# EAGLE design Teensylu-1.1 (EAGLE 7.1.0)
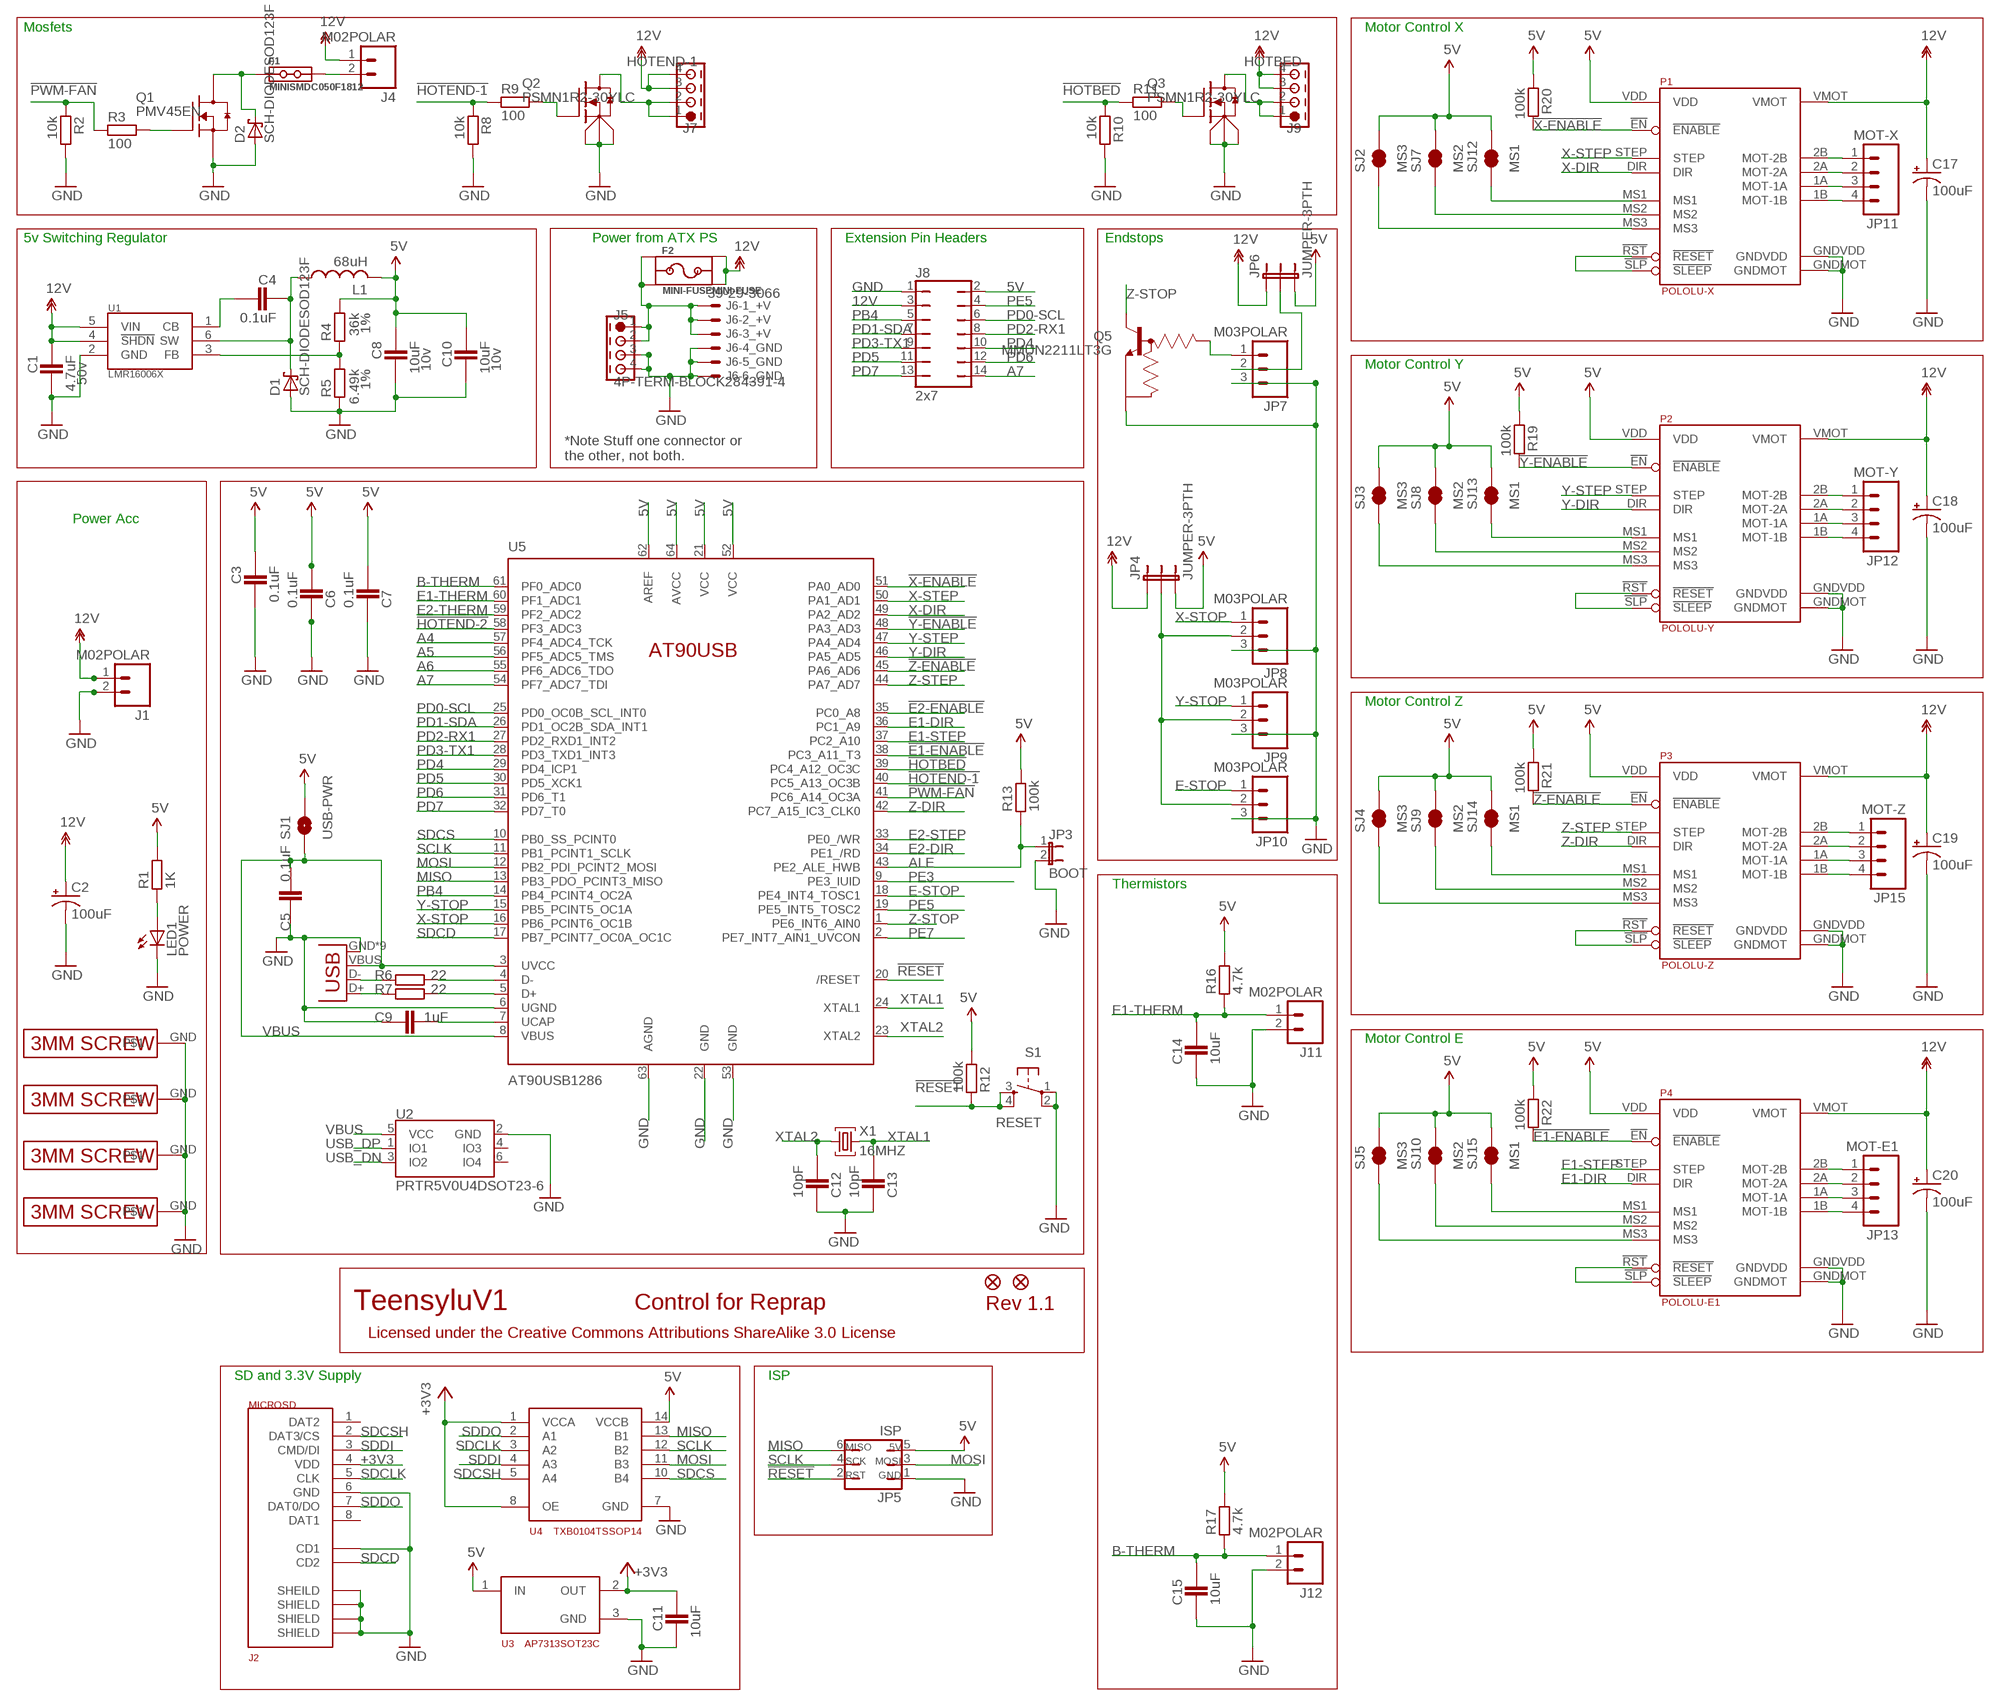
[diagram p0: schematic, sheet 1]

## Parts
C1  4.7uF  CAPACITOR_1206  [CAPC3215X168N]
C2  100uF  CPOL-USD  [PANASONIC_D]
C3  0.1uF  CAPACITOR_0603  [CAPC1608X92N]
C4  0.1uF  CAPACITOR_0603  [CAPC1608X92N]
C5  0.1uF  CAPACITOR_0603  [CAPC1608X92N]
C6  0.1uF  CAPACITOR_0603  [CAPC1608X92N]
C7  0.1uF  CAPACITOR_0603  [CAPC1608X92N]
C8  10uF  CAPACITOR_0805  [CAPC2012X145AN]
C9  1uF  CAPACITOR_0603  [CAPC1608X92N]
C10  10uF  CAPACITOR_0805  [CAPC2012X145AN]
C11  10uF  CAPACITOR_0603  [CAPC1608X92N]
C12  10pF  CAPACITOR_0603  [CAPC1608X92N]
C13  10pF  CAPACITOR_0603  [CAPC1608X92N]
C14  10uF  CAPACITOR_0603  [CAPC1608X92N]
C15  10uF  CAPACITOR_0603  [CAPC1608X92N]
C17  100uF  CPOL-USD  [PANASONIC_D]
C18  100uF  CPOL-USD  [PANASONIC_D]
C19  100uF  CPOL-USD  [PANASONIC_D]
C20  100uF  CPOL-USD  [PANASONIC_D]
D1  SCH-DIODESOD123F  [SOD123F]
D2  SCH-DIODESOD123F  [SOD123F]
F1  MINISMDC050F1812  [MINISMDC]
F2  MINI-FUSEMINI-FUSE  [MINI_FUSE]
J1  M02POLAR  [MOLEX-1X2]
J2  MICROSD  [AMPHENOL-MICROSD]
J3  USB-MICRO-PTH  [USB-MICROB-PTH]
J4  M02POLAR  [MOLEX-1X2]
J5  4P-TERM-BLOCK284391-4  [284391-4]
J6  39-29-3066  [39-29-3066]
J7  HOTEND-1  4P-TERM-BLOCK284391-4  [284391-4]
J8  2x7  JP7Q  [JP7Q]
J9  HOTBED  4P-TERM-BLOCK284391-4  [284391-4]
J11  M02POLAR  [MOLEX-1X2]
J12  M02POLAR  [MOLEX-1X2]
JP1  FIDUCIAL1X2.5  [FIDUCIAL-1X2.5]
JP2  FIDUCIAL1X2.5  [FIDUCIAL-1X2.5]
JP3  BOOT  JUMPER-2PTH  [1X02]
JP4  JUMPER-3PTH  [1X03]
JP5  ISP  PROGHEADER  [ISP]
JP6  JUMPER-3PTH  [1X03]
JP7  M03POLAR  [MOLEX-1X3]
JP8  M03POLAR  [MOLEX-1X3]
JP9  M03POLAR  [MOLEX-1X3]
JP10  M03POLAR  [MOLEX-1X3]
JP11  MOT-X  M04POLAR  [MOLEX-1X4]
JP12  MOT-Y  M04POLAR  [MOLEX-1X4]
JP13  MOT-E1  M04POLAR  [MOLEX-1X4]
JP15  MOT-Z  M04POLAR  [MOLEX-1X4]
L1  68uH  INDUCTORSRN6045  [SRN6045]
LED1  POWER  LEDCHIPLED_0805  [CHIPLED_0805]
P1  POLOLU-X  POLOLU-ALLEGRO  [POLOLU-STEPPER-PTH]
P2  POLOLU-Y  POLOLU-ALLEGRO  [POLOLU-STEPPER-PTH]
P3  POLOLU-Z  POLOLU-ALLEGRO  [POLOLU-STEPPER-PTH]
P4  POLOLU-E1  POLOLU-ALLEGRO  [POLOLU-STEPPER-PTH]
Q1  PMV45EN  MOSFET-NCH_SOT-23  [SOT23C]
Q2  PSMN1R2-30YLC  PSMN1R2-30YLCPOWERPACK-S08  [LFPACK-POWERPAK-SO8]
Q3  PSMN1R2-30YLC  PSMN1R2-30YLCPOWERPACK-S08  [LFPACK-POWERPAK-SO8]
Q5  MMUN2211LT3G  TRANSISTOR_NPN_BIASSOT23C  [SOT23C]
R1  1K  RESISTOR_0603  [RESC1608X55N]
R2  10k  RESISTOR_0603  [RESC1608X55N]
R3  100  RESISTOR_0603  [RESC1608X55N]
R4  36k  RESISTOR_0603  [RESC1608X55N]
R5  6.49k  RESISTOR_0603  [RESC1608X55N]
R6  22  RESISTOR_0603  [RESC1608X55N]
R7  22  RESISTOR_0603  [RESC1608X55N]
R8  10k  RESISTOR_0603  [RESC1608X55N]
R9  100  RESISTOR_0603  [RESC1608X55N]
R10  10k  RESISTOR_0603  [RESC1608X55N]
R11  100  RESISTOR_0603  [RESC1608X55N]
R12  100k  RESISTOR_0603  [RESC1608X55N]
R13  100k  RESISTOR_0603  [RESC1608X55N]
R16  4.7k  RESISTOR_0603  [RESC1608X55N]
R17  4.7k  RESISTOR_0603  [RESC1608X55N]
R19  100k  RESISTOR_0603  [RESC1608X55N]
R20  100k  RESISTOR_0603  [RESC1608X55N]
R21  100k  RESISTOR_0603  [RESC1608X55N]
R22  100k  RESISTOR_0603  [RESC1608X55N]
S1  RESET  TAC_SWITCHSMD  [TACTILE_SWITCH_SMD]
SCREW1  3MM-SCREW  [PLATEDSCREW]
SCREW2  3MM-SCREW  [PLATEDSCREW]
SCREW3  3MM-SCREW  [PLATEDSCREW]
SCREW4  3MM-SCREW  [PLATEDSCREW]
SJ1  USB-PWR  SOLDERJUMPERNO  [SJ_2S-NO]
SJ2  MS3  SOLDERJUMPER-NCSJ-TRACE  [SJ_2S-TRACE]
SJ3  MS3  SOLDERJUMPER-NCSJ-TRACE  [SJ_2S-TRACE]
SJ4  MS3  SOLDERJUMPER-NCSJ-TRACE  [SJ_2S-TRACE]
SJ5  MS3  SOLDERJUMPER-NCSJ-TRACE  [SJ_2S-TRACE]
SJ7  MS2  SOLDERJUMPER-NCSJ-TRACE  [SJ_2S-TRACE]
SJ8  MS2  SOLDERJUMPER-NCSJ-TRACE  [SJ_2S-TRACE]
SJ9  MS2  SOLDERJUMPER-NCSJ-TRACE  [SJ_2S-TRACE]
SJ10  MS2  SOLDERJUMPER-NCSJ-TRACE  [SJ_2S-TRACE]
SJ12  MS1  SOLDERJUMPER-NCSJ-TRACE  [SJ_2S-TRACE]
SJ13  MS1  SOLDERJUMPER-NCSJ-TRACE  [SJ_2S-TRACE]
SJ14  MS1  SOLDERJUMPER-NCSJ-TRACE  [SJ_2S-TRACE]
SJ15  MS1  SOLDERJUMPER-NCSJ-TRACE  [SJ_2S-TRACE]
U1  LMR16006X  [TSOT6]
U2  PRTR5V0U4DSOT23-6  [SOT23-6]
U3  AP7313SOT23C  [SOT23C]
U4  TXB0104TSSOP14  [TSSOP14]
U5  AT90USB1286  AT90USB  [TQFP64-2]
X1  16MHZ  XTAL  [NDK-XTAL]

## Nets
5V [power]: C3.1 C6.2 C7.2 C8.1 C10.1 J8.2 JP4.3 JP5.5 JP6.3 L1.2 P1.VDD P2.VDD P3.VDD P4.VDD R1.2 R4.1 R12.2 R13.2 R16.2 R17.2 R19.1 R20.1 R21.1 R22.1 SJ1.2 SJ2.2 SJ3.2 SJ4.2 SJ5.2 SJ7.2 SJ8.2 SJ9.2 SJ10.2 SJ12.2 SJ13.2 SJ14.2 SJ15.2 U3.1(IN) U4.14(VCCB) U5.21(VCC) U5.52(VCC) U5.62(AREF) U5.64(AVCC)
5VREG_CB: C4.2 U1.1(CB)
5VREG_FB: R4.2 R5.1 U1.3(FB)
5VREG_SW: C4.1 D1.C L1.1 U1.6(SW)
12V: C1.1 C2.+ C17.+ C18.+ C19.+ C20.+ F2.P$3 F2.P$4 J1.1 J4.1 J7.3 J7.4 J8.3 J9.3 J9.4 JP4.1 JP6.1 P1.VMOT P2.VMOT P3.VMOT P4.VMOT U1.4(!SHDN) U1.5(VIN)
12V_FUSE: F2.P$1 F2.P$2 J5.1 J5.2 J6.1 J6.2 J6.3
!E1-ENABLE: P4.!EN(!ENABLE) R22.2 U5.38(PC3_A11_T3)
!E2-ENABLE: U5.35(PC0_A8)
!HOTBED: R10.1 R11.1 U5.39(PC4_A12_OC3C)
!HOTEND-1: R8.1 R9.1 U5.40(PC5_A13_OC3B)
!HOTEND-2: U5.58(PF3_ADC3)
!PWM-FAN: R2.1 R3.1 U5.41(PC6_A14_OC3A)
!RESET: JP5.2 R12.1 S1.3 S1.4 U5.20(/RESET)
!X-ENABLE: P1.!EN(!ENABLE) R20.2 U5.51(PA0_AD0)
!Y-ENABLE: P2.!EN(!ENABLE) R19.2 U5.48(PA3_AD3)
!Z-ENABLE: P3.!EN(!ENABLE) R21.2 U5.45(PA6_AD6)
+3V3 [power]: C11.1 J2.4(VDD) U3.2(OUT) U4.1(VCCA) U4.8(OE)
A4: U5.57(PF4_ADC4_TCK)
A5: U5.56(PF5_ADC5_TMS)
A6: U5.55(PF6_ADC6_TDO)
A7: J8.14 U5.54(PF7_ADC7_TDI)
ALE: JP3.1 R13.1 U5.43(PE2_ALE_HWB)
B-THERM: C15.2 J12.1 R17.1 U5.61(PF0_ADC0)
E1-DIR: P4.DIR U5.36(PC1_A9)
E1-STEP: P4.STEP U5.37(PC2_A10)
E1-THERM: C14.2 J11.1 R16.1 U5.60(PF1_ADC1)
E2-DIR: U5.34(PE1_/RD)
E2-STEP: U5.33(PE0_/WR)
E2-THERM: U5.59(PF2_ADC2)
E-MOT-1A [power]: JP13.3 P4.1A(MOT-1A)
E-MOT-1B [power]: JP13.4 P4.1B(MOT-1B)
E-MOT-2A [power]: JP13.2 P4.2A(MOT-2A)
E-MOT-2B [power]: JP13.1 P4.2B(MOT-2B)
E-MS1: P4.MS1 SJ15.1
E-MS2: P4.MS2 SJ10.1
E-MS3: P4.MS3 SJ5.1
E-RESETSLEEP: P4.!RST(!RESET) P4.!SLP(!SLEEP)
E-STOP: JP10.1 U5.18(PE4_INT4_TOSC1)
ENDSTOP+V: JP4.2 JP8.2 JP9.2 JP10.2
GND [power]: C1.2 C2.- C3.2 C5.1 C6.1 C7.1 C8.2 C9.1 C10.2 C11.2 C12.1 C13.1 C14.1 C15.1 C17.- C18.- C19.- C20.- D1.A D2.A J1.2 J2.6(GND) J2.C1(SHEILD) J2.C2(SHIELD) J2.C3(SHIELD) J2.C4(SHIELD) J2.CD1 J3.GND J3.GND1(GND) J3.GND2(GND) J3.GND3(GND) J3.GND4(GND) J3.GND5(GND) J3.GND6(GND) J3.GND7(GND) J3.GND8(GND) J5.3 J5.4 J6.4 J6.5 J6.6 J8.1 J11.2 J12.2 JP3.2 JP5.1 JP7.3 JP8.3 JP9.3 JP10.3 LED1.C P1.GNDMOT P1.GNDVDD P2.GNDMOT P2.GNDVDD P3.GNDMOT P3.GNDVDD P4.GNDMOT P4.GNDVDD Q1.2(S) Q2.1(S1) Q2.2(S2) Q2.3(S3) Q3.1(S1) Q3.2(S2) Q3.3(S3) Q5.2(E) R2.2 R5.2 R8.2 R10.2 S1.1 S1.2 SCREW1.GND SCREW2.GND SCREW3.GND SCREW4.GND U1.2(GND) U2.2(GND) U3.3(GND) U4.7(GND) U5.6(UGND) U5.22(GND) U5.53(GND) U5.63(AGND)
HOTBED-GND [power]: J9.1 J9.2 Q3.5-8(D)
HOTEND-GND [power]: J7.1 J7.2 Q2.5-8(D)
MISO: JP5.6 U4.13(B1) U5.13(PB3_PDO_PCINT3_MISO)
MOSI: JP5.3 U4.11(B3) U5.12(PB2_PDI_PCINT2_MOSI)
N$1: LED1.A R1.1
N$2: Q3.4(G) R11.2
N$3: R6.2 U5.4(D-)
N$4: R7.2 U5.5(D+)
N$5: F1.P$2 J4.2
N$6: D2.C F1.P$1 Q1.3(D)
N$10: Q1.1(G) R3.2
N$11: Q2.4(G) R9.2
PB4: J8.5 U5.14(PB4_PCINT4_OC2A)
PD0-SCL: J8.6 U5.25(PD0_OC0B_SCL_INT0)
PD1-SDA: J8.7 U5.26(PD1_OC2B_SDA_INT1)
PD2-RX1: J8.8 U5.27(PD2_RXD1_INT2)
PD3-TX1: J8.9 U5.28(PD3_TXD1_INT3)
PD4: J8.10 U5.29(PD4_ICP1)
PD5: J8.11 U5.30(PD5_XCK1)
PD6: J8.12 U5.31(PD6_T1)
PD7: J8.13 U5.32(PD7_T0)
PE3: U5.9(PE3_IUID)
PE5: J8.4 U5.19(PE5_INT5_TOSC2)
PE7: U5.2(PE7_INT7_AIN1_UVCON)
SCLK: JP5.4 U4.12(B2) U5.11(PB1_PCINT1_SCLK)
SDCD: J2.CD2 U5.17(PB7_PCINT7_OC0A_OC1C)
SDCLK: J2.5(CLK) U4.3(A2)
SDCS: U4.10(B4) U5.10(PB0_SS_PCINT0)
SDCSH: J2.2(DAT3/CS) U4.5(A4)
SDDI: J2.3(CMD/DI) U4.4(A3)
SDDO: J2.7(DAT0/DO) U4.2(A1)
UCAP: C9.2 U5.7(UCAP)
USB_DN: J3.D- R6.1 U2.3(IO2)
USB_DP: J3.D+ R7.1 U2.1(IO1)
VBUS: C5.2 J3.VBUS SJ1.1 U2.5(VCC) U5.3(UVCC) U5.8(VBUS)
X-DIR: P1.DIR U5.49(PA2_AD2)
X-MOT-1A [power]: JP11.3 P1.1A(MOT-1A)
X-MOT-1B [power]: JP11.4 P1.1B(MOT-1B)
X-MOT-2A [power]: JP11.2 P1.2A(MOT-2A)
X-MOT-2B [power]: JP11.1 P1.2B(MOT-2B)
X-MS1: P1.MS1 SJ12.1
X-MS2: P1.MS2 SJ7.1
X-MS3: P1.MS3 SJ2.1
X-RESETSLEEP: P1.!RST(!RESET) P1.!SLP(!SLEEP)
X-STEP: P1.STEP U5.50(PA1_AD1)
X-STOP: JP8.1 U5.16(PB6_PCINT6_OC1B)
XTAL1: C13.2 U5.24(XTAL1) X1.P$2
XTAL2: C12.2 U5.23(XTAL2) X1.P$1
Y-DIR: P2.DIR U5.46(PA5_AD5)
Y-MOT-1A [power]: JP12.3 P2.1A(MOT-1A)
Y-MOT-1B [power]: JP12.4 P2.1B(MOT-1B)
Y-MOT-2A [power]: JP12.2 P2.2A(MOT-2A)
Y-MOT-2B [power]: JP12.1 P2.2B(MOT-2B)
Y-MS1: P2.MS1 SJ13.1
Y-MS2: P2.MS2 SJ8.1
Y-MS3: P2.MS3 SJ3.1
Y-RESETSLEEP: P2.!RST(!RESET) P2.!SLP(!SLEEP)
Y-STEP: P2.STEP U5.47(PA4_AD4)
Y-STOP: JP9.1 U5.15(PB5_PCINT5_OC1A)
Z-DIR: P3.DIR U5.42(PC7_A15_IC3_CLK0)
Z-MOT-1A [power]: JP15.3 P3.1A(MOT-1A)
Z-MOT-1B [power]: JP15.4 P3.1B(MOT-1B)
Z-MOT-2A [power]: JP15.2 P3.2A(MOT-2A)
Z-MOT-2B [power]: JP15.1 P3.2B(MOT-2B)
Z-MS1: P3.MS1 SJ14.1
Z-MS2: P3.MS2 SJ9.1
Z-MS3: P3.MS3 SJ4.1
Z-RESETSLEEP: P3.!RST(!RESET) P3.!SLP(!SLEEP)
Z-STEP: P3.STEP U5.44(PA7_AD7)
Z-STOP: Q5.3(C) U5.1(PE6_INT6_AIN0)
Z-STOP-BIAS: JP7.1 Q5.1(B)
Z-STOP-SUPPLY: JP6.2 JP7.2
Unconnected: J2.1(DAT2) J2.8(DAT1) U2.4(IO3) U2.6(IO4)

## Notes on the sheet
- Mosfets | Motor Control X
- 5v Switching Regulator | Power from ATX PS | Extension Pin Headers | Endstops
- Motor Control Y
- *Note Stuff one connector or
  the other, not both.
- Power Acc
- Motor Control Z
- Thermistors
- Motor Control E
- TeensyluV1 | Control for Reprap | Rev 1.1
- Licensed under the Creative Commons Attributions ShareAlike 3.0 License
- SD and 3.3V Supply | ISP

## Library data of the parts
C1 = teensylu:CAPACITOR_; MANUFACTURER: Yaiyo Yuden; MANUFACTURER_PART_NUMBER: UMK316AB7475KL-T; TOLERANCE: 10%; VDC: 50v
C2 C17-C20 = teensylu:CPOL-US: POLARIZED CAPACITOR, American symbol; MANUFACTURER: Panasonic; MANUFACTURER_PART_NUMBER: EEE-FTH101XAP; TOLERANCE: 20%; VDC: 50v
C3 C5-C7 = teensylu:CAPACITOR_; MANUFACTURER: Murata; MANUFACTURER_PART_NUMBER: GRM188R71C104KA01D; TOLERANCE: 10%; VDC: 16V
C4 = teensylu:CAPACITOR_; MANUFACTURER: Samsung; MANUFACTURER_PART_NUMBER: CL10B104KB8NNNC; TOLERANCE: 10%; VDC: 50V
C8 C10 = teensylu:CAPACITOR_; ESR: 0.0030; MANUFACTURER: Murata; MANUFACTURER_PART_NUMBER: GRM21BR71A106KE51L; TOLERANCE: 10%; VDC: 10v
C9 = teensylu:CAPACITOR_; MANUFACTURER: Samsung; MANUFACTURER_PART_NUMBER: CL10A105MO8NNNC; TOLERANCE: 20%; VDC: 16V
C11 C14 C15 = teensylu:CAPACITOR_; MANUFACTURER: Murata; MANUFACTURER_PART_NUMBER: GRM188R61C106MA73D; TOLERANCE: 20%; VDC: 16V
C12 C13 = teensylu:CAPACITOR_; MANUFACTURER: Samsung; MANUFACTURER_PART_NUMBER: CL10C100JB8NCNC; TOLERANCE: 5%; VDC: 50V
D1 D2 = teensylu:SCH-DIODE: Schottky Diodes Source: Fairchild .. BAT54.pdf; CURRENT: 1A; MANUFACTURER: NXP Semiconductors; MANUFACTURER_PART_NUMBER: PMEG4010CEH,115; REVERSE_VOLTAGE: 40V
F1 = teensylu:MINISMDC050F; CURRENT: 0.5A; MANUFACTURER: TE Connectivity; MANUFACTURER_PART_NUMBER: MINISMDC050F-2
F2 = teensylu:MINI-FUSE; CURRENT: 15A; MANUFACTURER: Keystone; MANUFACTURER_PART_NUMBER: 3568
J1 J4 J11 J12 = teensylu:M02: Header 2 Standard 2-pin 0.1" header. Use with straight break away headers (SKU : PRT-00116), right angle break away headers (PRT-00553), swiss pins (PRT-00743), machine pins (PRT-00117), and female headers (PRT-00115). Molex polarized connector foot print use with SKU : PRT-08233 with associated crimp pins and housings.; DESCRIPTION: CONN HEADER 2POS .100 VERT TIN; MANUFACTURER: Molex; MANUFACTURER_PART_NUMBER: 0022272021; NOTES: Can use alternative part for Right Angle. MFG: TE Connectivity PN: 640455-2
J2 = teensylu:MICROSD; DESCRIPTION: CONN MICRO SD CARD PUSH-PULL R/A; MANUFACTURER: Amphenol; MANUFACTURER_PART_NUMBER: 114-00841-68
J3 = teensylu:USB: USB Connectors USB-B-PTH is fully proven SKU : PRT-00139 USB-miniB is fully proven SKU : PRT-00587 USB-A-PCB is untested. USB-A-H is throughly reviewed, but untested. Spark Fun Electronics SKU : PRT-00437 USB-B-SMT is throughly reviewed, but untested. Needs silkscreen touching up. USB-A-S has not been used/tested USB-MB-H has not been used/tested; MANUFACTURER: FCI; MANUFACTURER_PART_NUMBER: 10118194-0001LF
J5 J7 J9 = teensylu:4P-TERM-BLOCK; CURRENT: 12A; MANUFACTURER: TE Connectivity; MANUFACTURER_PART_NUMBER: 284391-4
J6 = teensylu:39-29-3066: Mini FIT connector 6 pol Without Snap-in peg Source: http://www.molex.com; MANUFACTURER: Molex; MANUFACTURER_PART_NUMBER: 0039293066
J8 = teensylu:JP7Q: JUMPER; DESCRIPTION: DIL VERTICAL PC TAIL PIN HEADER; MANUFACTURER: Harwin; MANUFACTURER_PART_NUMBER: M20-9980746
JP1 JP2 = SparkFun:FIDUCIAL: Fiducial Alignment Points Various fiducial points for machine vision alignment.
JP3 = teensylu:JUMPER-2: Jumper Basic 0.1" spaced jumper. Use with breakaway headers.; DESCRIPTION: SIL VERTICAL PC TAIL PIN HEADER; MANUFACTURER: Harwin; MANUFACTURER_PART_NUMBER: M20-9990246
JP4 JP6 = teensylu:JUMPER-3
JP5 = teensylu:PROGHEADER: JUMPER
JP7-JP10 = teensylu:M03: Header 3 Standard 3-pin 0.1" header. Use with straight break away headers (SKU : PRT-00116), right angle break away headers (PRT-00553), swiss pins (PRT-00743), machine pins (PRT-00117), and female headers (PRT-00115). Molex polarized connector foot print use with SKU : PRT-08232 with associated crimp pins and housings.; DESCRIPTION: CONN HEADER 3POS .100 VERT TIN; MANUFACTURER: Molex; MANUFACTURER_PART_NUMBER: 0022272031; NOTES: Can use alternative part for Right Angle. MFG: TE Connectivity PN: 640455-3
JP11-JP13 JP15 = teensylu:M04: Header 4 Standard 4-pin 0.1" header. Use with straight break away headers (SKU : PRT-00116), right angle break away headers (PRT-00553), swiss pins (PRT-00743), machine pins (PRT-00117), and female headers (PRT-00115). Molex polarized connector foot print use with SKU : PRT-08231 with associated crimp pins and housings. 1MM SMD Version SKU: PRT-10208; DESCRIPTION: CONN HEADER 4POS .100 VERT TIN; MANUFACTURER: Molex; MANUFACTURER_PART_NUMBER: 0022272041; NOTES: Can use alternative part for Right Angle. MFG: TE Connectivity PN: 640455-4
L1 = teensylu:INDUCTOR; CURRENT: 900mA; DCR: 0.351; INDUCTANCE: 68uH; IRMS: 0.9A; MANUFACTURER: Bourns; MANUFACTURER_PART_NUMBER: SRN6045-680M
LED1 = teensylu:LED: LED OSRAM: - CHIPLED LG R971, LG N971, LY N971, LG Q971, LY Q971, LO R971, LY R971 LH N974, LH R974 LS Q976, LO Q976, LY Q976 LO Q996 - Hyper CHIPLED LW Q18S LB Q993, LB Q99A, LB R99A - SideLED LS A670, LO A670, LY A670, LG A670, LP A670 LB A673, LV A673, LT A673, LW A673 LH A674 LY A675 LS A676, LA A676, LO A676, LY A676, LW A676 LS A679, LY A679, LG A679 - Hyper Micro SIDELED® LS Y876, LA Y876, LO Y876, LY Y876 LT Y87S - SmartLED LW L88C, LW L88S LB L89C, LB L89S, LG L890 LS L89K, LO L89K, LY L89K LS L896, LA L896, LO L896, LY L896 - TOPLED LS T670, LO T670, LY T670, LG T670, LP T670 LSG T670, LSP T670, LSY T670, LOP T670, LYG T670 LG T671, LOG T671, LSG T671 LB T673, LV T673, LT T673, LW T673 LH T674 LS T676, LA T676, LO T676, LY T676, LB T676, LH T676, LSB T676, LW T676 LB T67C, LV T67C, LT T67C, LS T67K, LO T67K, LY T67K, LW E67C LS E67B, LA E67B, LO E67B, LY E67B, LB E67C, LV E67C, LT E67C LW T67C LS T679, LY T679, LG T679 LS T770, LO T770, LY T770, LG T770, LP T770 LB T773, LV T773, LT T773, LW T773 LH T774 LS E675, LA E675, LY E675, LS T675 LS T776, LA T776, LO T776, LY T776, LB T776 LHGB T686 LT T68C, LB T68C - Hyper Mini TOPLED® LB M676 - Mini TOPLED Santana® LG M470 LS M47K, LO M47K, LY M47K Source: http://www.osram.convergy.de LUXEON: - LUMILED® LXK2-PW12-R00, LXK2-PW12-S00, LXK2-PW14-U00, LXK2-PW14-V00 LXK2-PM12-R00, LXK2-PM12-S00, LXK2-PM14-U00 LXK2-PE12-Q00, LXK2-PE12-R00, LXK2-PE12-S00, LXK2-PE14-T00, LXK2-PE14-U00 LXK2-PB12-K00, LXK2-PB12-L00, LXK2-PB12-M00, LXK2-PB14-N00, LXK2-PB14-P00, LXK2-PB14-Q00 LXK2-PR12-L00, LXK2-PR12-M00, LXK2-PR14-Q00, LXK2-PR14-R00 LXK2-PD12-Q00, LXK2-PD12-R00, LXK2-PD12-S00 LXK2-PH12-R00, LXK2-PH12-S00 LXK2-PL12-P00, LXK2-PL12-Q00, LXK2-PL12-R00 Source: www.luxeon.com KINGBRIGHT: KA-3528ASYC Source: www.kingbright.com; MANUFACTURER: Kingbright; MANUFACTURER_PART_NUMBER: APT2012SGC
P1-P4 = teensylu:POLOLU-ALLEGRO
Q1 = teensylu:MOSFET-NCH_; CURRENT: 1.2A; MANUFACTURER: International Rectifier; MANUFACTURER_PART_NUMBER: IRLML2060TRPBF; VOLTAGE: 60V
Q2 Q3 = teensylu:PSMN1R2-30YLC: N-Channel MOSFET - 30V 100A LFPAK; CURRENT: 100A; MANUFACTURER: NXP Semiconductors; MANUFACTURER_PART_NUMBER: PSMN1R2-30YLC,115; RDS_ON: 1.25mOhm; VGS: 1.95V; VOLTAGE: 30V
Q5 = teensylu:TRANSISTOR_NPN_BIAS: Transistor NPN BJT configuration in SOT23 package. MMBT2222 is the common NPN we use. Double check BCE configuration again layout.; DESCRIPTION: TRANS PREBIAS NPN 246MW SOT23-3; MANUFACTURER: ON Semiconductor; MANUFACTURER_PART_NUMBER: MMUN2211LT3G
R1-R3 R6-R13 R16 R17 R19-R22 = teensylu:RESISTOR_
R4 R5 = teensylu:RESISTOR_; TOLERANCE: 1%
S1 = teensylu:TAC_SWITCH: Momentary Switch Button commonly used for reset or general input. Spark Fun Electronics SKU : COM-00097; MANUFACTURER: Bourns; MANUFACTURER_PART_NUMBER: 7914J-1-000E
SCREW1-SCREW4 = teensylu:3MM-SCREW: 3mm Plated Through Hole Screw
SJ1 = teensylu:SOLDERJUMPER: Solder Jumper Standard SMD solder jumper. Used to automate production. Two varients : Normally Open and Normally Closed are the same, but have different paste layers. NC will have a large amount of paste and should jumper during reflow.
SJ2-SJ5 SJ7-SJ10 SJ12-SJ15 = teensylu:SOLDERJUMPER-NC
U1 = teensylu:LMR16006X: Texas Instruments LMR16006XDDCT; CURRENT: 600mA; MANUFACTURER: Texas Instruments; MANUFACTURER_PART_NUMBER: LMR16006XDDCT
U2 = teensylu:PRTR5V0U4D: NXP Semiconductors PRTR5V0U4D,125; MANUFACTURER: NXP Semiconductors; MANUFACTURER_PART_NUMBER: PRTR5V0U4D,125
U3 = teensylu:AP7313; CURRENT: 150mA; DESCRIPTION: IC REG LDO 3.3V 0.15A SOT23-3; MANUFACTURER: Diodes Incorporated; MANUFACTURER_PART_NUMBER: AP7313-33SAG-7; VOLTAGE_OUTPUT: 3.3V
U4 = teensylu:TXB0104; DESCRIPTION: IC VOLT-LEVEL TRANSLATOR 14TSSOP; MANUFACTURER: Texas Instruments; MANUFACTURER_PART_NUMBER: TXB0104PWR
U5 = teensylu:AT90USB; MANUFACTURER: Atmel; MANUFACTURER_PART_NUMBER: AT90USB1286
X1 = teensylu:XTAL; MANUFACTURER: NDK; MANUFACTURER_PART_NUMBER: NX5032GA-16.000000MHZ-LN-CD-1

## Board
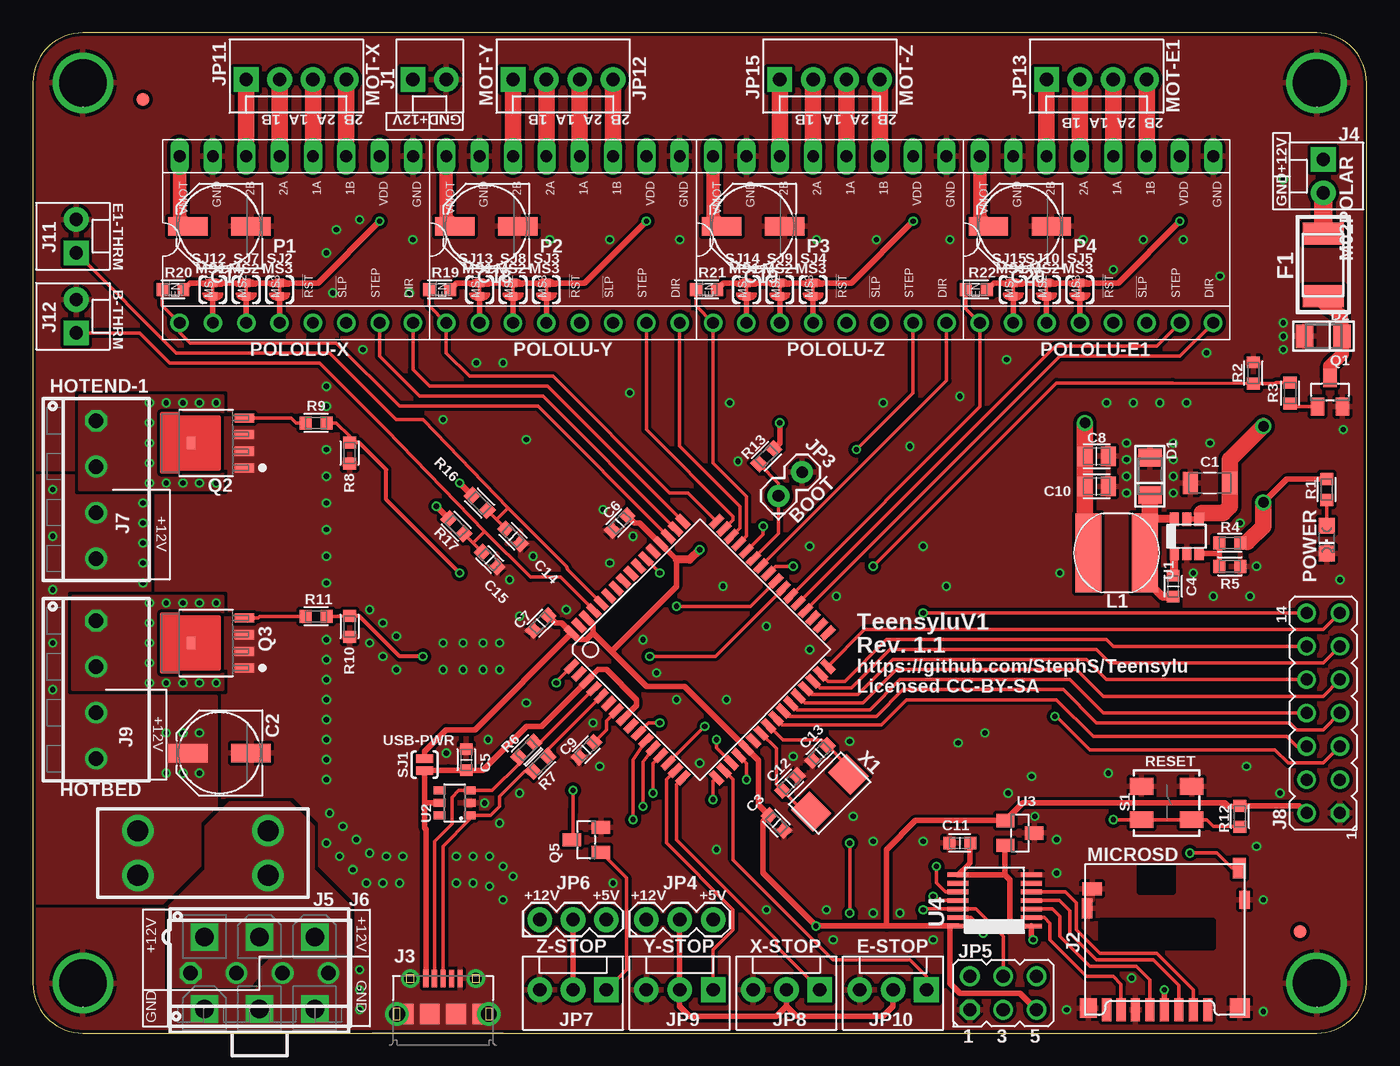
[diagram p1: board, top side]
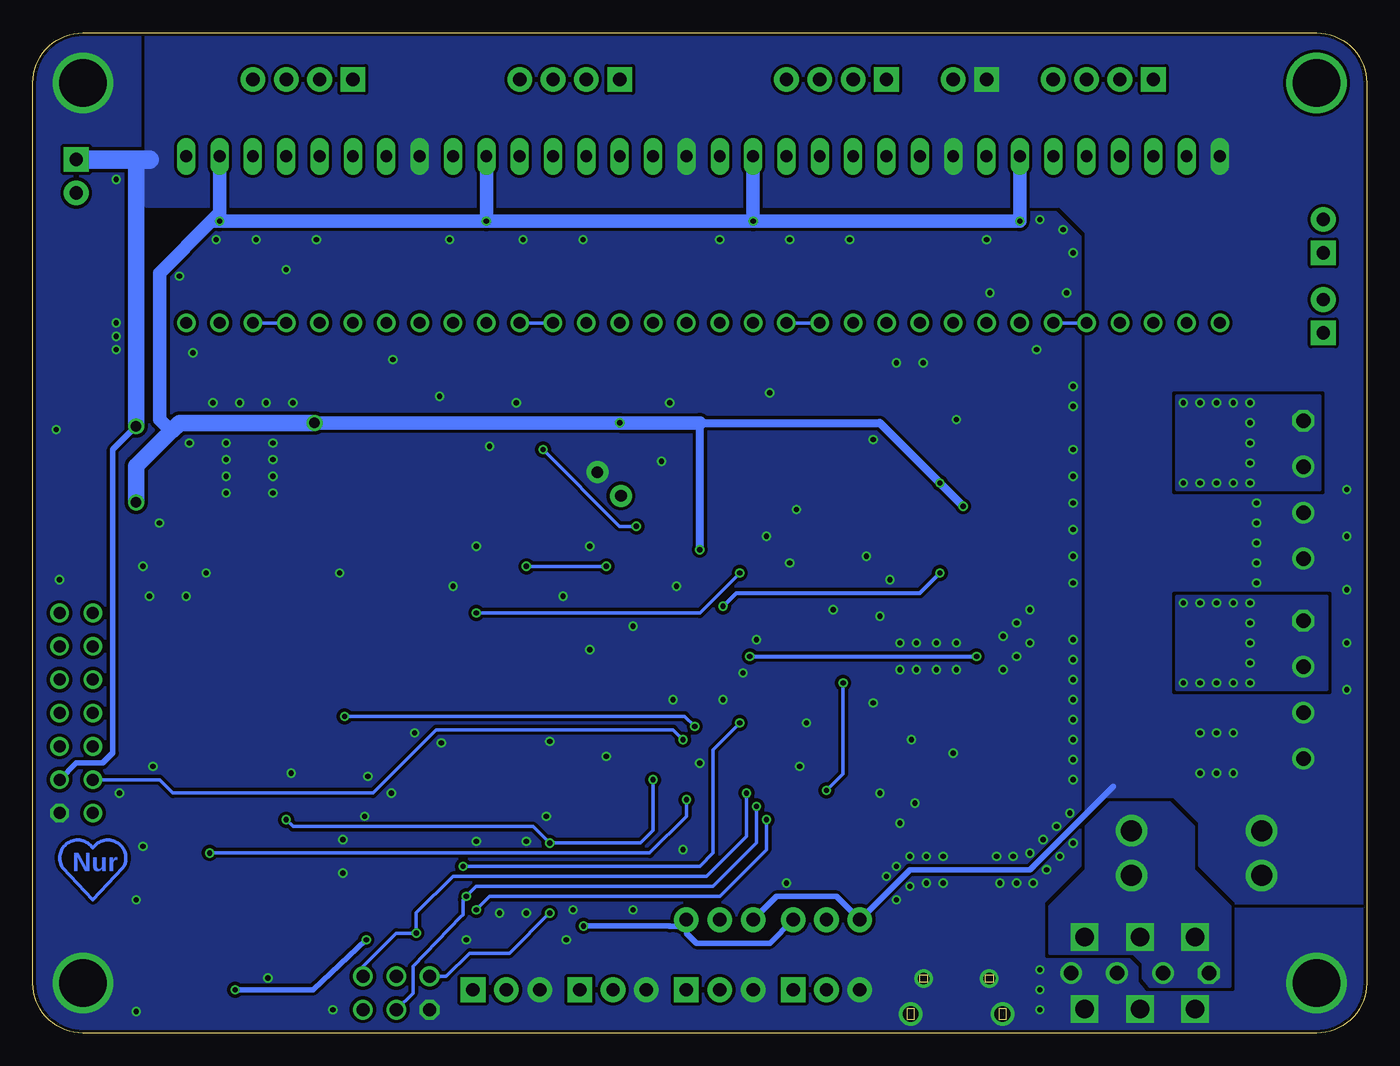
[diagram p2: board, bottom side, seen from below]

Size 101.6 x 76.2 mm. Coordinates in mm from the lower left corner, seen from the top.
Outline: 0,3.81 arc90 3.81,0 97.79,0 arc90 101.6,3.81 101.6,72.39 arc90 97.79,76.2 3.81,76.2 arc90 0,72.39 0,3.81
Copper layers (1*16): Top 0.035mm / dielectric 1.5mm / Bottom 0.035mm
Design rules "Teensylu Custom *": minimum track width 10mil, minimum drill 15mil, track to track 9mil, track to pad 9mil, pad to pad 9mil, via to via 9mil, smd to smd 0mil, copper to edge 10mil, drill to drill 10mil, minimum pad ring 10mil, minimum via ring 6mil, stop-mask expansion 2mil, vias tented up to drill 100mil, thermal gap 10mil

### Footprints (pad centres in the part's own frame; a part is rotated, then mirrored left to right if it is on the bottom)
CAPC3215X168N = smd 1.15 x 1.65: 1 -1.5,0; 2 1.5,0
PANASONIC_D = smd 3 x 1.4: + 2.4,0; - -2.4,0
CAPC1608X92N = smd 0.9 x 0.95: 1 -0.8,0; 2 0.8,0
CAPC2012X145AN = smd 1.15 x 1.45: 1 -0.9,0; 2 0.9,0
SOD123F = smd 1.34 x 1.8: A 1.43,0; C -1.43,0
MINISMDC = smd 1.676 x 3.15: P$1 -2.286,0; P$2 2.489,0
MINI_FUSE = drill 1.6: P$1 -4.953,1.702; P$2 -4.953,-1.702; P$3 4.953,-1.702; P$4 4.953,1.702
MOLEX-1X2 = drill 1.016 pad 1.88 square: 1 0,0 | drill 1.016 pad 1.88: 2 2.54,0
AMPHENOL-MICROSD = smd 0.7 x 1.75: 1 3.636,-5.842; 2 2.536,-5.842; 3 1.436,-5.842; 4 0.336,-5.842; 5 -0.764,-5.842; 6 -1.864,-5.842; 7 -2.964,-5.842; 8 -4.064,-5.842 | smd 1.29 x 1.5: C1 -5.464,-5.717 | smd 1.5 x 1.5: C2 6.086,-5.717 | smd 0.8 x 1.5: C3 -5.539,1.883 | smd 0.8 x 1.4: C4 6.436,2.533 | smd 1.5 x 1: CD1 -5.164,3.383 | smd 1 x 1.55: CD2 6.036,4.958
USB-MICROB-PTH = smd 0.4 x 1.35: D+ 0,2.699; D- -0.65,2.699; GND 1.3,2.699; ID 0.65,2.699; VBUS -1.3,2.699 | drill 1.2 pad 1.676: GND1 -3.5,-0.001; GND6 3.5,-0.001 | smd 1.225 x 1.55: GND2 -2.86,-0.001 | smd 1.5 x 1.55: GND3 -1,-0.001; GND4 1,-0.001 | smd 1.2 x 1.55: GND5 2.86,-0.001 | drill 0.9 pad 1.27: GND7 2.5,2.7; GND8 -2.5,2.7
284391-4 = drill 1.1 octagon: 1 -5.25,0 | drill 1.1: 2 -1.753,0; 3 1.753,0; 4 5.25,0
39-29-3066 = drill 1.4 square: 1 4.2,-2.75; 2 0,-2.75; 3 -4.2,-2.75; 4 4.2,2.75; 5 0,2.75; 6 -4.2,2.75
JP7Q = drill 0.914 octagon: 1 -7.62,-1.27 | drill 0.914: 2 -7.62,1.27; 3 -5.08,-1.27; 4 -5.08,1.27; 5 -2.54,-1.27; 6 -2.54,1.27; 7 0,-1.27; 8 0,1.27; 9 2.54,-1.27; 10 2.54,1.27; 11 5.08,-1.27; 12 5.08,1.27; 13 7.62,-1.27; 14 7.62,1.27
FIDUCIAL-1X2.5 = smd 1 x 1: 1 0,0
1X02 = drill 0.9 pad 1.676: 1 0,0; 2 2.54,0
1X03 = drill 1.016 pad 1.88: 1 0,0; 2 2.54,0; 3 5.08,0
ISP = drill 1 octagon: 1 -2.54,-1.27 | drill 1: 2 -2.54,1.27; 3 0,-1.27; 4 0,1.27; 5 2.54,-1.27; 6 2.54,1.27
MOLEX-1X3 = drill 1.016 pad 1.88 square: 1 0,0 | drill 1.016 pad 1.88: 2 2.54,0; 3 5.08,0
MOLEX-1X4 = drill 1.016 pad 1.88 square: 1 0,0 | drill 1.016 pad 1.88: 2 2.54,0; 3 5.08,0; 4 7.62,0
SRN6045 = smd 2 x 6: 1 -2.15,0; 2 2.15,0
CHIPLED_0805 = smd 1.2 x 1.2: A 0,-1.05; C 0,1.05
POLOLU-STEPPER-PTH = drill 0.9 long: 1A 6.35,-1.27; 1B 6.35,-3.81; 2A 6.35,1.27; 2B 6.35,3.81; GNDMOT 6.35,6.35; GNDVDD 6.35,-8.89; VDD 6.35,-6.35; VMOT 6.35,8.89 | drill 0.9: !EN -6.35,8.89; !RST -6.35,-1.27; !SLP -6.35,-3.81; DIR -6.35,-8.89; MS1 -6.35,6.35; MS2 -6.35,3.81; MS3 -6.35,1.27; STEP -6.35,-6.35
SOT23C = smd 1 x 1.4: 1 -0.95,-1.1; 2 0.95,-1.1; 3 0,1.1
LFPACK-POWERPAK-SO8 = smd 0.7 x 1.5: 1 -1.905,-2.9; 2 -0.635,-2.9; 3 0.635,-2.9; 4 1.905,-2.9 | smd 0.9 x 0.6: 5-8 0,1.15
RESC1608X55N = smd 0.9 x 1: 1 -0.8,0; 2 0.8,0
TACTILE_SWITCH_SMD = smd 1.78 x 1.27: 1 -1.905,1.27; 2 1.905,1.27; 3 -1.905,-1.27; 4 1.905,-1.27
PLATEDSCREW = drill 3.6: GND 0,0
SJ_2S-NO = smd 0.635 x 1.27: 1 -0.45,0; 2 0.45,0
SJ_2S-TRACE = smd 0.635 x 0.635: 1 -0.508,0; 2 0.508,0
TSOT6 = smd 0.69 x 1: 1 -0.95,-1.3; 2 0,-1.3; 3 0.95,-1.3; 4 0.95,1.3; 5 0,1.3; 6 -0.95,1.3
SOT23-6 = smd 0.6 x 0.9: 1 -0.95,-1.15; 2 0,-1.15; 3 0.95,-1.15; 4 0.95,1.15; 5 0,1.15; 6 -0.95,1.15
TSSOP14 = smd 0.35 x 1.6: 1 -2,-2.9; 2 -1.35,-2.9; 3 -0.7,-2.9; 4 -0.05,-2.9; 5 0.6,-2.9; 6 1.25,-2.9; 7 1.9,-2.9; 8 1.9,2.7; 9 1.25,2.7; 10 0.6,2.7; 11 -0.05,2.7; 12 -0.7,2.7; 13 -1.35,2.7; 14 -2,2.7
TQFP64-2 = smd 1.194 x 0.508: 1 -7.8,6; 2 -7.8,5.2; 3 -7.8,4.4; 4 -7.8,3.6; 5 -7.8,2.8; 6 -7.8,2; 7 -7.8,1.2; 8 -7.8,0.4; 9 -7.8,-0.4; 10 -7.8,-1.2; 11 -7.8,-2; 12 -7.8,-2.8; 13 -7.8,-3.6; 14 -7.8,-4.4; 15 -7.8,-5.2; 16 -7.8,-6; 33 7.8,-6; 34 7.8,-5.2; 35 7.8,-4.4; 36 7.8,-3.6; 37 7.8,-2.8; 38 7.8,-2; 39 7.8,-1.2; 40 7.8,-0.4; 41 7.8,0.4; 42 7.8,1.2; 43 7.8,2; 44 7.8,2.8; 45 7.8,3.6; 46 7.8,4.4; 47 7.8,5.2; 48 7.8,6 | smd 0.508 x 1.194: 17 -6,-7.8; 18 -5.2,-7.8; 19 -4.4,-7.8; 20 -3.6,-7.8; 21 -2.8,-7.8; 22 -2,-7.8; 23 -1.2,-7.8; 24 -0.4,-7.8; 25 0.4,-7.8; 26 1.2,-7.8; 27 2,-7.8; 28 2.8,-7.8; 29 3.6,-7.8; 30 4.4,-7.8; 31 5.2,-7.8; 32 6,-7.8; 49 6,7.8; 50 5.2,7.8; 51 4.4,7.8; 52 3.6,7.8; 53 2.8,7.8; 54 2,7.8; 55 1.2,7.8; 56 0.4,7.8; 57 -0.4,7.8; 58 -1.2,7.8; 59 -2,7.8; 60 -2.8,7.8; 61 -3.6,7.8; 62 -4.4,7.8; 63 -5.2,7.8; 64 -6,7.8
NDK-XTAL = smd 2 x 2.4: P$1 -2,0; P$2 2,0

### Placement (x,y rotation side)
C1  89.66,41.91 180 top
C2  14.22,21.34 180 top
C3  56.64,16 315 top
C4  86.87,34.04 90 top
C5  33.02,20.83 270 top
C6  44.7,38.86 45 top
C7  38.69,31.24 45 top
C8  81.03,43.94 0 top
C9  42.16,21.59 45 top
C10  81.03,41.66 0 top
C11  70.61,14.48 180 top
C12  57.66,19.05 225 top
C13  59.94,21.34 45 top
C14  36.58,37.85 135 top
C15  34.8,36.07 135 top
C17  14.22,61.47 180 top
C18  34.54,61.47 180 top
C19  54.86,61.47 180 top
C20  75.18,61.47 180 top
D1  85.09,42.42 90 top
D2  98.3,53.09 180 top
F1  98.3,58.42 90 top
F2  12.95,13.72 180 top
J1  28.96,72.64 0 top
J2  85.85,7.62 0 top
J3  31.24,1.46 0 top
J4  98.3,66.55 270 top
J5  17.27,4.57 0 top
J6  17.27,4.57 180 top
J7  4.83,41.4 270 top
J8  98.3,24.38 90 top
J9  4.83,26.16 270 top
J11  3.3,59.44 90 top
J12  3.3,53.34 90 top
JP1  8.38,71.12 0 top
JP2  96.52,7.75 0 top
JP3  56.81,40.93 45 top
JP4  46.74,8.64 0 top
JP5  73.91,3.05 0 top
JP6  38.61,8.64 0 top
JP7  43.69,3.3 180 top
JP8  59.94,3.3 180 top
JP9  51.82,3.3 180 top
JP10  68.07,3.3 180 top
JP11  16.26,72.64 0 top
JP12  36.58,72.64 0 top
JP13  77.22,72.64 0 top
JP15  56.9,72.64 0 top
L1  82.55,36.58 180 top
LED1  98.55,37.59 180 top
P1  20.07,60.45 90 top
P2  40.39,60.45 90 top
P3  60.71,60.45 90 top
P4  81.03,60.45 90 top
Q1  98.81,48.83 0 top
Q2  13.21,44.96 90 top
Q3  13.21,29.72 90 top
Q5  42.16,14.73 90 top
R1  98.55,41.4 90 top
R2  92.96,50.29 90 top
R3  95.76,48.77 270 top
R4  91.19,37.34 180 top
R5  91.19,35.56 0 top
R6  37.59,21.59 45 top
R7  38.67,20.51 45 top
R8  24.13,44.2 270 top
R9  21.59,46.48 180 top
R10  24.13,30.99 270 top
R11  21.59,31.75 180 top
R12  91.95,16.51 90 top
R13  55.88,43.94 45 top
R16  34.04,40.39 135 top
R17  32.26,38.61 135 top
R19  30.99,56.64 180 top
R20  10.67,56.64 180 top
R21  51.31,56.64 180 top
R22  71.88,56.64 180 top
S1  86.36,17.53 0 top
SCREW1  3.81,72.39 0 top
SCREW2  3.81,3.81 0 top
SCREW3  97.79,72.39 0 top
SCREW4  97.79,3.81 0 top
SJ1  29.84,20.45 90 top
SJ2  18.8,56.64 90 top
SJ3  39.12,56.64 90 top
SJ4  59.44,56.64 90 top
SJ5  79.76,56.64 90 top
SJ7  16.26,56.64 90 top
SJ8  36.58,56.64 90 top
SJ9  56.9,56.64 90 top
SJ10  77.22,56.64 90 top
SJ12  13.72,56.64 90 top
SJ13  34.04,56.64 90 top
SJ14  54.36,56.64 90 top
SJ15  74.68,56.64 90 top
U1  87.88,37.85 0 top
U2  32.13,17.53 90 top
U3  75.18,15.24 270 top
U4  73.15,10.16 90 top
U5  50.8,29.21 45 top
X1  60.71,18.29 45 top

### Tracks (layer width: path | path; a pad name or v marks a point on that pad's centre or on a via)
5V  (via drill 0.4, 0.4 pad 0.25, 0.8)
  Top 0.254: R12.2 92.42,17.27
  Top 0.406: R22.1 73.19,57.15 SJ15.2 SJ10.2 SJ5.2 82.68,57.15 v87.38,61.85 | U5.64 41.55,29.97 42.16,29.97 42.67,30.48 | U4.14 69.85,8.16 | 69.85,8.16 65.02,8.16 | 65.02,8.16 v59.66,8.16 55.63,12.19 55.63,16.12 C3.1 55.26,17.38 55.26,20.79 U5.21 49.63,26.42 46.74,26.42 44.07,29.08 | JP5.5 75.18,3.05 70.61,3.05 69.85,3.81 69.85,8.16 | 65.02,8.16 65.02,13.97 67.24,16.19 U3.1 75.42,17.53 90.81,17.53 91.06,17.27 92.42,17.27 | J8.2 96.48,17.31 R12.2 | SJ1.2 29.84,21.46 31.5,23.11 33.67,23.11 U5.64 | R13.2 56.9,44.96 v56.9,46.48 | U5.62 42.67,31.11 42.67,30.48 | 42.67,30.48 44.07,29.08 | 44.07,29.08 49.02,34.04 49.02,36.06 49.03,36.07 U5.52 46.23,38.87 45.82,38.87 C6.2 | R16.2 33.02,41.4 v32.51,41.91 | R17.2 30.99,39.88 v30.73,40.13 | C7.2 39.81,31.24 40.28,31.24 U5.64 | R20.1 11.98,57.15 SJ12.2 SJ7.2 SJ2.2 21.72,57.15 v26.42,61.85 | R19.1 32.3,57.15 SJ13.2 SJ8.2 SJ3.2 42.04,57.15 v46.74,61.85 | R21.1 52.62,57.15 SJ14.2 SJ9.2 SJ4.2 62.36,57.15 v67.06,61.85 | R1.2 95.5,42.2 v93.73,40.42
  Top 0.61: v50.8,36.83 50.04,36.07 49.03,36.07
  Top 0.889: R4.1 92.49,37.41
  Top 1.27: v80.14,46.48 80.14,45.73 C8.1 C10.1 80.15,39.12 L1.2 | 92.49,37.41 93.73,38.61 v93.73,40.42
  Bottom 0.406: v59.66,8.16 53.09,8.16 53.09,8.13 52.58,8.13 JP4.3 51.82,7.62 51.05,6.86 45.47,6.86 JP6.3 | v87.38,61.85 87.38,62.23 87.63,62.23
  Bottom 0.61: v50.8,36.83 50.8,46.48 37.08,46.48 v32.51,41.91 v30.73,40.13
  Bottom 1.016: v80.14,46.48 v56.9,46.48 50.8,46.48 | P4.VDD 87.38,62.48 87.63,62.23 88.01,61.85 | 88.01,61.85 91.95,57.91 91.95,46.74 91.06,45.85 | P3.VDD v67.06,61.85 | v67.06,61.85 v87.38,61.85 88.01,61.85 | P2.VDD v46.74,61.85 | v46.74,61.85 v67.06,61.85 | P1.VDD v26.42,61.85 v46.74,61.85
  Bottom 1.27: v80.14,46.48 90.42,46.48 91.06,45.85 93.73,43.18 v93.73,40.42
5VREG_CB
  Top 0.61: C4.2 86.93,35.33 U1.1
5VREG_FB
  Top 0.406: U1.3 90.39,36.55 | 90.39,36.55 R4.2 | R5.1 90.39,36.55
5VREG_SW
  Top 0.61: U1.6 85.09,39.15 | C4.1 86.08,33.24 84.7,34.62 L1.1
  Top 0.813: 85.09,39.15 D1.C
  Top 1.27: L1.1 85.09,36.58 D1.C
12V  (via drill 0.4, 0.8)
  Top 0.406: U1.5 U1.4
  Top 0.61: 89.06,39.62 U1.4
  Top 1.016: P1.VMOT 11.18,62.12 C17.+ | P2.VMOT 31.5,62.12 C18.+ | P3.VMOT 51.82,62.12 C19.+ | P4.VMOT 72.14,62.12 C20.+
  Top 1.27: v93.73,46.23 91.19,43.69 C1.1 91.19,40.13 90.68,39.62 89.06,39.62
  Bottom 0.406: 19.3,18.8 25.65,12.45 34.8,12.45 JP6.1 40.39,10.41 44.96,10.41 JP4.1 | J8.3 98.3,20.57 96.27,20.57 95.5,21.34 95.5,44.45 v93.73,46.23
  Bottom 1.27: 93.73,66.55 v93.73,46.23
  Bottom 1.422: J4.1 93.73,66.55 92.71,66.55
  other vias: 10.16,22.86 10.16,19.81 11.43,19.81 11.43,22.86 1.52,29.72 1.52,33.78 1.52,37.85 1.52,41.4 1.52,26.16 12.7,22.86 12.7,19.81 8.38,40.39 8.38,38.86 8.38,37.34 8.38,35.81 8.38,34.29
  pour Bottom (rank 2, no thermals): 21.34,9.91 21.34,60.96 23.37,62.99 92.96,62.99 92.96,77.98 -1.27,77.98 -1.27,9.91
  pour Top (rank 2, no thermals): 9.91,9.91 0.25,9.91 0.25,42.42 8.89,42.42 8.89,25.65 13.97,25.65 13.97,17.27 12.7,16 12.7,12.7
12V_FUSE
  pour Top (no thermals): 13.21,12.45 13.21,15.75 14.99,17.53 19.56,17.53 21.34,15.75 21.34,12.45 24.13,9.65 24.13,6.1 17.78,6.1 17.02,5.33 17.02,4.19 16.51,3.56 10.41,3.56 10.41,9.65
  pour Bottom (no thermals): 10.41,9.65 13.21,12.45 13.21,15.73 15,17.53 19.56,17.53 21.34,15.75 21.34,12.45 24.13,9.65 24.13,6.1 17.78,6.1 17.02,5.33 17.02,4.19 16.51,3.56 10.41,3.56
!E1-ENABLE
  Top 0.254: U5.38 72.14,47.72 P4.!EN 71.08,55.16 R22.2
!HOTBED  (via drill 0.4)
  Top 0.254: U5.39 51.99,28.7 v46.99,28.7 | R11.1 23.33,31.75 R10.1
  Top 0.305: v29.72,28.7 27.94,28.7 24.85,31.79 R10.1
  Bottom 0.305: v46.99,28.7 v29.72,28.7
!HOTEND-1  (via drill 0.4)
  Top 0.254: R8.1 24.13,45.47 23.11,46.48 R9.1 | U5.40 54.67,32.51 v49.02,32.51
  Top 0.305: v32.51,35.05 26.92,40.64 26.92,42.93 24.85,45 R8.1
  Bottom 0.305: v49.02,32.51 48.01,33.53 34.04,33.53 v32.51,35.05
!PWM-FAN  (via drill 0.4)
  Top 0.254: v64.01,35.56 77.98,49.53 86.83,49.53 R2.1 94.53,49.49 94.7,49.57 R3.1 | U5.41 56.58,35.56 v57.91,35.56
  Bottom 0.254: v57.91,35.56 v64.01,35.56
!RESET  (via drill 0.4)
  Top 0.254: v62.23,9.14 v62.23,14.48 | R12.1 91.69,15.75 89.92,15.75 89.41,16.26 S1.4 S1.3 v82.3,16.26 | U5.20 54.36,20.56 v54.36,19.3
  Bottom 0.254: JP5.2 70.1,4.32 68.33,6.1 65.28,6.1 v62.23,9.14 | v82.3,16.26 81.79,15.75 63.5,15.75 v62.23,14.48 55.33,14.48 54.36,15.45 v54.36,19.3
!X-ENABLE
  Top 0.254: U5.51 38.48,47.75 27.94,47.75 23.11,52.58 11.98,52.58 11.18,53.38 P1.!EN 9.87,55.41 R20.2
!Y-ENABLE
  Top 0.254: U5.48 49.89,41.15 48.51,41.15 39.62,50.04 33.27,50.04 31.5,51.82 P2.!EN 30.19,55.41 R19.2
!Z-ENABLE
  Top 0.254: U5.45 54.36,37.86 54.36,40.89 51.82,43.43 P3.!EN 50.51,55.41 R21.2
+3V3  (via drill 0.4)
  Top 0.254: 74.04,14.35 U3.2
  Top 0.406: 74.04,12.06 U4.8 71.21,12.79 71.37,12.95 71.37,14.59 C11.1 | 74.04,12.06 74.05,12.06 74.42,11.68 74.42,8.64 74.93,8.13 75.51,8.13 U4.1 76.05,7.26 v76.2,7.11 | v86.19,3.3 J2.4 | 74.04,12.06 74.04,13.74 U3.2
  Bottom 0.406: v86.19,3.3 80.26,3.3 v76.2,7.11
A7  (via drill 0.4)
  Top 0.254: J8.14 v67.82,32 | U5.54 47.75,35.09 v47.75,35.05
  Bottom 0.254: v47.75,35.05 50.8,32 v67.82,32
ALE
  Top 0.254: U5.43 56.81,38.05 JP3.1 56.81,41.88 R13.1
B-THERM
  Top 0.254: U5.61 40.18,34.74 37.9,34.74 34.42,38.23 | 34.42,38.23 26.92,45.97 21.84,51.05 10.41,51.05 8.13,53.34 J12.1 | R17.1 | R17.1 33.53,37.34 | 33.53,37.34 34.42,38.23 | C15.2 33.53,37.34
E1-DIR
  Top 0.254: U5.36 78.24,51.56 87.38,51.56 P4.DIR
E1-STEP
  Top 0.254: U5.37 77.87,52.32 85.6,52.32 P4.STEP
E1-THERM
  Top 0.254: U5.60 40.74,35.31 40.64,35.56 36.2,40.01 | 36.2,40.01 29.72,46.74 27.69,46.74 22.61,51.82 10.92,51.82 J11.1 | R16.1 35.31,39.12 | 35.31,39.12 36.2,40.01 | C14.2 35.31,39.12
E-MOT-1A
  Top 1.27: P4.1A JP13.3
E-MOT-1B
  Top 1.27: P4.1B JP13.4
E-MOT-2A
  Top 1.27: P4.2A JP13.2
E-MOT-2B
  Top 1.27: P4.2B JP13.1
E-MS1
  Top 0.406: P4.MS1 SJ15.1
E-MS2
  Top 0.406: P4.MS2 SJ10.1
E-MS3
  Top 0.406: P4.MS3 SJ5.1
E-RESETSLEEP
  Bottom 0.254: P4.!RST P4.!SLP
E-STOP
  Top 0.254: JP10.1 68.07,4.32 66.8,5.59 60.96,5.59 53.34,13.21 53.34,19.32 U5.18
ENDSTOP+V
  Top 0.406: 57.4,2.03 56.64,1.27 50.04,1.27 49.28,2.03 JP9.2 JP4.2 | JP8.2 57.4,2.03 | 57.4,2.03 58.17,1.27 64.77,1.27 65.53,2.03 JP10.2
GND  (via drill 0.4, 0.4 pad 0.25)
  other vias: 34.42,17.53 24.89,4.83 24.89,3.3 24.89,1.78 46.48,29.97 67.82,14.61 70.48,22.1 77.98,12.19 57.91,21.08 62.48,16.51 50.8,20.57 49.02,25.4 47.5,27.43 59.18,29.21 52.58,34.04 37.59,45.21 45.72,37.85 43.94,35.81 64.01,14.61 66.04,9.14 89.92,33.27 93.73,10.16 93.73,1.65 93.22,14.22 92.46,20.32 72.52,22.86 76.33,16.51 74.17,51.31 61.21,33.27 67.82,37.08 69.6,34.04 86.87,42.42 53.09,48.01 64.77,48.01 53.72,43.56 70.61,48.51 66.8,44.7 59.18,37.08 85.85,48.01 78.23,35.05 83.82,48.01 87.88,48.01 92.71,33.27 99.57,34.54 43.18,20.32 26.67,28.7 42.67,23.62 26.92,13.46 22.35,14.48 23.37,13.46 24.38,12.45 22.35,29.97 33.78,51.05 22.35,34.29 89.41,51.82 25.65,32.26 22.35,28.45 22.61,16.76 23.62,15.75 26.67,11.43 27.94,11.43 28.19,13.46 22.35,26.92 22.35,25.4 22.35,23.88 22.35,38.35 22.35,36.32 28.7,56.39 22.86,56.39 22.35,47.75 25.15,52.07 60.45,9.4 64.01,9.14 78.74,1.78 45.47,48.77 43.43,39.88 52.83,25.4 55.88,30.99 34.8,13.46 83.69,4.19 31.5,21.34 77.98,14.73 62.23,22.23 25.4,11.43 24.64,14.73 25.65,13.72 34.67,22.35 35.56,27.69 27.69,30.23 37.59,25.15 34.29,27.69 74.3,18.29 22.35,22.35 52.07,13.97 32.77,27.69 27.69,27.69 35.81,51.05 88.39,35.05 89.66,44.96 86.87,41.15 86.87,43.69 83.31,43.69 83.31,42.42 83.31,41.15 93.22,35.56 95.25,54.1 95.25,52.07 76.07,19.56 81.92,19.81 81.79,48.01 31.24,46.74 38.1,36.32 36.32,34.54 37.08,31.75 40.64,32.26 33.53,13.46 35.81,12.7 35.56,16 37.08,18.29 95,18.29 55.88,9.4 68.58,7.11 60.96,7.11 36.58,11.94 44.2,11.43 32.26,13.46 22.35,40.39 22.35,42.42 31.24,27.69 34.29,29.72 25.65,29.72 26.67,31.24 31.24,29.72 95.25,53.09 28.96,60.45 49.28,60.45 69.85,60.45 82.3,58.17 23.11,61.21 43.94,60.45 64.26,60.45 84.58,60.45 24.89,61.98 39.37,60.45 59.69,60.45 80.01,60.45 90.42,57.66 87.63,60.45 95.25,65.02 22.35,49.28 32.77,29.72 22.35,44.45 22.35,59.44 83.31,44.96 86.87,44.96 91.95,38.86 99.82,45.97 32.26,11.43 33.53,11.43 34.8,11.18 35.81,10.16 35.56,29.72 22.35,20.83 22.35,19.3
  pour Top (isolate 0.254, rank 6): -6.35,78.23 106.68,78.23 106.68,-3.05 -6.35,-3.05
  pour Bottom (isolate 0.254, rank 6, no thermals): -5.08,76.96 105.41,76.96 105.41,-1.78 -5.08,-1.78
  pour Bottom (rank 2, no thermals): 24.13,5.59 18.08,5.59 17.53,5.03 17.53,3.94 16.76,3.05 10.41,3.05 10.41,0 24.13,0
HOTBED-GND  (via drill 0.4)
  other vias: 8.89,32.77 10.16,32.77 11.43,32.77 12.7,32.77 13.97,32.77 13.97,26.67 12.7,26.67 11.43,26.67 10.16,26.67 8.89,26.67 8.89,28.19 8.89,29.72 8.89,31.24
  pour Bottom (no thermals): 3.05,33.27 14.48,33.27 14.48,26.16 3.05,26.16
  pour Top (no thermals): 3.05,33.27 14.48,33.27 14.48,26.16 3.05,26.16
HOTEND-GND  (via drill 0.4)
  other vias: 8.89,48.01 8.89,41.91 8.89,43.43 8.89,44.96 8.89,46.48 13.97,48.01 12.7,48.01 11.43,48.01 10.16,48.01 10.16,41.91 11.43,41.91 12.7,41.91 13.97,41.91
  pour Bottom (no thermals): 3.56,48.51 14.48,48.51 14.48,41.4 3.56,41.4
  pour Top (no thermals): 3.56,48.51 14.48,48.51 14.48,41.4 3.56,41.4
MISO  (via drill 0.4)
  Top 0.254: v72.39,7.62 71.88,8.13 71.88,8.38 71.45,8.81 U4.13 | U5.13 47.24,20.56 v47.24,18.29
  Bottom 0.254: JP5.6 76.45,5.08 73.91,7.62 v72.39,7.62 72.39,9.14 69.6,11.94 50.29,11.94 47.24,14.99 v47.24,18.29
MOSI  (via drill 0.4)
  Top 0.254: v68.58,10.41 69.01,10.11 U4.11 | U5.12 46.48,20.68 v46.48,17.27
  Bottom 0.254: JP5.3 72.64,3.05 72.64,5.08 68.96,8.89 68.83,9.02 68.83,10.16 v68.58,10.41 67.82,11.18 49.78,11.18 46.48,14.48 v46.48,17.27
N$1
  Top 0.254: LED1.A R1.1
N$2
  Top 0.254: Q3.4 17.14,31.62 17.27,31.75 R11.2
N$3
  Top 0.254: U5.4 38.66,22.16 R6.2
N$4
  Top 0.254: U5.5 39.42,21.79 39.37,21.74 39.24,21.61 R7.2
N$5
  Top 1.422: F1.P$2 J4.2
N$6
  Top 1.016: Q1.3 98.81,50.8 99.73,51.72 D2.C 99.66,54.7 98.3,55.63 F1.P$1
N$8
  Bottom 0.254: 99.31,12.57 arc180 97.03,14.1 arc180 94.74,12.57 97.03,10.16 99.31,12.57
N$10
  Top 0.254: R3.2 96.03,47.73 Q1.1
N$11
  Top 0.254: Q2.4 19.68,46.86 20.07,46.48 R9.2
PB4  (via drill 0.4)
  Top 0.254: v77.85,24.13 77.98,24.13 80.52,21.59 94.61,21.59 95.63,20.57 98.3,20.57 J8.5 | U5.14 v51.18,23.37
  Bottom 0.254: v77.85,24.13 51.94,24.13 v51.18,23.37
PD0-SCL
  Top 0.254: J8.6 96.27,21.84 95.5,22.61 80.77,22.61 77.98,25.4 66.55,25.4 64.64,23.5 57.08,23.5 U5.25
PD1-SDA
  Top 0.254: J8.7 98.3,23.11 96.27,23.11 95.76,23.62 81.03,23.62 78.49,26.16 66.29,26.16 64.26,24.13 57.58,24.13 U5.26
PD2-RX1
  Top 0.254: J8.8 81.53,24.38 78.99,26.92 66.04,26.92 63.75,24.64 58.2,24.64 U5.27
PD3-TX1
  Top 0.254: J8.9 98.3,25.65 81.53,25.65 79.5,27.69 65.79,27.69 63.25,25.15 58.82,25.15 U5.28
PD4
  Top 0.254: J8.10 81.79,26.92 80.26,28.45 65.53,28.45 62.87,25.78 59.32,25.78 U5.29
PD5
  Top 0.254: J8.11 98.3,28.19 82.04,28.19 81.03,29.21 65.28,29.21 62.36,26.29 59.94,26.29 U5.30
PD6
  Top 0.254: J8.12 82.3,29.46 81.79,29.97 65.02,29.97 61.85,26.8 60.57,26.8 U5.31
PD7
  Top 0.254: J8.13 98.3,30.73 63.35,30.73 U5.32
PE5  (via drill 0.4)
  Top 0.254: U5.19 52.07,21.72 v52.07,22.35
  Bottom 0.254: J8.4 91.95,19.3 90.93,18.29 75.69,18.29 70.87,23.11 52.83,23.11 v52.07,22.35
SCLK  (via drill 0.4)
  Top 0.254: JP5.4 73.91,7.37 71.82,9.46 U4.12 67.88,9.46 v67.82,9.4 | U5.11 45.72,20.79 v45.72,16.26
  Bottom 0.254: v67.82,9.4 66.8,10.41 49.28,10.41 45.72,13.97 v45.72,16.26
SDCD  (via drill 0.4)
  Top 0.254: v88.14,13.72 90.17,13.72 91.31,12.58 J2.CD2 | U5.17 51.82,19.2 v51.82,17.78
  Bottom 0.254: v88.14,13.72 54.61,13.72 51.82,16.51 v51.82,17.78
SDCLK
  Top 0.254: U4.3 77.66,9.46 78.23,8.89 78.23,7.37 80.52,5.08 84.07,5.08 85.09,4.06 J2.5
  Top 0.305: J2.5
SDCS  (via drill 0.4)
  Top 0.254: U4.10 69.5,10.76 68.83,11.43 v68.83,12.7 | U5.10 46.91,23.62 v47.75,23.62
  Bottom 0.254: v47.75,23.62 49.78,21.59 49.78,13.72 50.8,12.7 v68.83,12.7
SDCSH
  Top 0.254: U4.5 78.65,10.76 79.5,9.91 79.5,7.87 81.28,6.1 85.6,6.1 88.39,3.3 J2.2
SDDI
  Top 0.254: U4.4 78.19,10.11 78.99,9.31 78.99,7.62 81.03,5.59 85.34,5.59 87.29,3.64 J2.3
SDDO
  Top 0.254: U4.2 77.04,8.81 77.47,8.38 77.47,7.11 80.26,4.32 82.3,4.32 82.89,3.73 J2.7
UCAP
  Top 0.254: C9.2 43.69,23.11 43.69,23.8 U5.7
USB_DN
  Top 0.254: J3.D- 30.59,5.07 30.61,5.21 30.61,14.61 31.94,15.94 31.94,17.97 32.45,18.48 U2.3 34.99,18.48 37.03,20.52 R6.1
USB_DP
  Top 0.254: J3.D+ 31.24,14.22 33.28,16.26 U2.1 34.86,16.58 35.56,17.27 35.56,18.03 37.47,19.95 R7.1
VBUS
  Top 0.406: J3.VBUS 29.94,15.52 29.84,15.62 29.84,17.53 | U2.5 29.84,17.53 | 29.84,17.53 SJ1.1 31.65,20.03 C5.2 34.25,20.03 37.59,23.37 38.73,23.37 U5.3 43.05,27.69 43.69,27.69 45.97,25.4 45.97,24.95 U5.8
X-DIR
  Top 0.254: U5.49 39.22,49.28 30.23,49.28 28.96,50.55 P1.DIR
X-MOT-1A
  Top 1.27: P1.1A JP11.3
X-MOT-1B
  Top 1.27: P1.1B JP11.4
X-MOT-2A
  Top 1.27: P1.2A JP11.2
X-MOT-2B
  Top 1.27: P1.2B JP11.1
X-MS1
  Top 0.406: SJ12.1 P1.MS1
X-MS2
  Top 0.406: SJ7.1 P1.MS2
X-MS3
  Top 0.406: SJ2.1 P1.MS3
X-RESETSLEEP
  Bottom 0.254: P1.!RST P1.!SLP
X-STEP
  Top 0.254: U5.50 38.85,48.51 37.34,48.51 37.08,48.51 29.46,48.51 26.42,51.56 P1.STEP
X-STOP
  Top 0.254: JP8.1 56.64,6.6 56.64,7.11 49.02,14.73 49.02,18.95 U5.16
XTAL1
  Top 0.254: U5.24 56.09,23.41 57.15,22.35 60.06,22.35 C13.2 61.87,20.55 X1.P$2
XTAL2
  Top 0.254: U5.23 56.64,21.67 56.64,18.93 C12.2 58.7,16.87 X1.P$1
Y-DIR
  Top 0.254: U5.46 53.85,38.48 53.85,40.13 49.28,44.7 P2.DIR
Y-MOT-1A
  Top 1.27: P2.1A JP12.3
Y-MOT-1B
  Top 1.27: P2.1B JP12.4
Y-MOT-2A
  Top 1.27: P2.2A JP12.2
Y-MOT-2B
  Top 1.27: P2.2B JP12.1
Y-MS1
  Top 0.406: P2.MS1 SJ13.1
Y-MS2
  Top 0.406: P2.MS2 SJ8.1
Y-MS3
  Top 0.406: P2.MS3 SJ3.1
Y-RESETSLEEP
  Bottom 0.254: P2.!RST P2.!SLP
Y-STEP
  Top 0.254: U5.47 53.34,39.1 53.34,39.37 46.74,45.97 P2.STEP
Y-STOP
  Top 0.254: U5.15 48.26,19.32 48.26,14.48 53.34,9.4 53.34,7.87 51.82,6.35 JP9.1
Z-DIR
  Top 0.254: U5.42 69.6,49.7 P3.DIR
Z-MOT-1A
  Top 1.27: P3.1A JP15.3
Z-MOT-1B
  Top 1.27: P3.1B JP15.4
Z-MOT-2A
  Top 1.27: P3.2A JP15.2
Z-MOT-2B
  Top 1.27: P3.2B JP15.1
Z-MS1
  Top 0.406: P3.MS1 SJ14.1
Z-MS2
  Top 0.406: P3.MS2 SJ9.1
Z-MS3
  Top 0.406: P3.MS3 SJ4.1
Z-RESETSLEEP
  Bottom 0.254: P3.!RST P3.!SLP
Z-STEP  (via drill 0.4)
  Top 0.254: U5.44 55.63,38 v55.63,38.61 | v62.74,44.45 67.06,48.77 P3.STEP
  Bottom 0.254: v55.63,38.61 56.9,38.61 v62.74,44.45
Z-STOP  (via drill 0.4)
  Top 0.254: v41.15,18.48 41.15,17.02 41.15,16.76 41.15,14.73 Q5.3 | U5.1 39.88,26.77 v39.88,26.67
  Bottom 0.254: v39.88,26.67 39.88,19.75 v41.15,18.48
Z-STOP-BIAS
  Top 0.254: JP7.1 45.21,4.83 45.21,11.83 Q5.1
Z-STOP-SUPPLY
  Top 0.406: JP6.2 JP7.2

### Text on the board
Bottom: Nur
_tsilk: 2B 2A 1A 1B | +12V | GND | 2B 2A 1A 1B | 2B 2A 1A 1B | 2B 2A 1A 1B | +12V | E1-THRM | GND | B-THRM | +12V | TeensyluV1 | 14 | Rev. 1.1 | https://github.com/StephS/Teensylu | Licensed CC-BY-SA | +12V | 1 | +12V | +5V | +12V | +5V | +12V | +12V | Z-STOP | Y-STOP | X-STOP | E-STOP | GND | GND